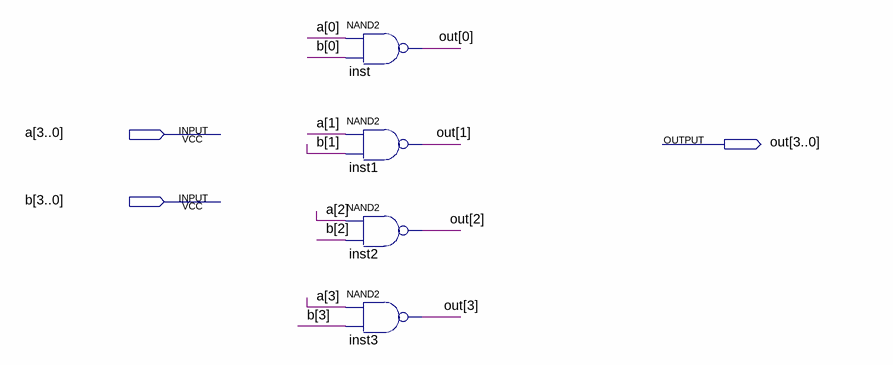
[diagram p0: schematic sheet]
// Quartus schematic nand_4bit.bdf as structural Verilog: 4 symbols, 3 pins
module nand_4bit (
  input  [3:0] a,
  input  [3:0] b,
  output [3:0] out
);

  nand inst (out[0], a[0], b[0]);
  nand inst1 (out[1], a[1], b[1]);
  nand inst2 (out[2], a[2], b[2]);
  nand inst3 (out[3], a[3], b[3]);
endmodule
